# EAGLE design Franzininho (EAGLE 9.0.1)
CNAME: Franzininho; VERSION: V2
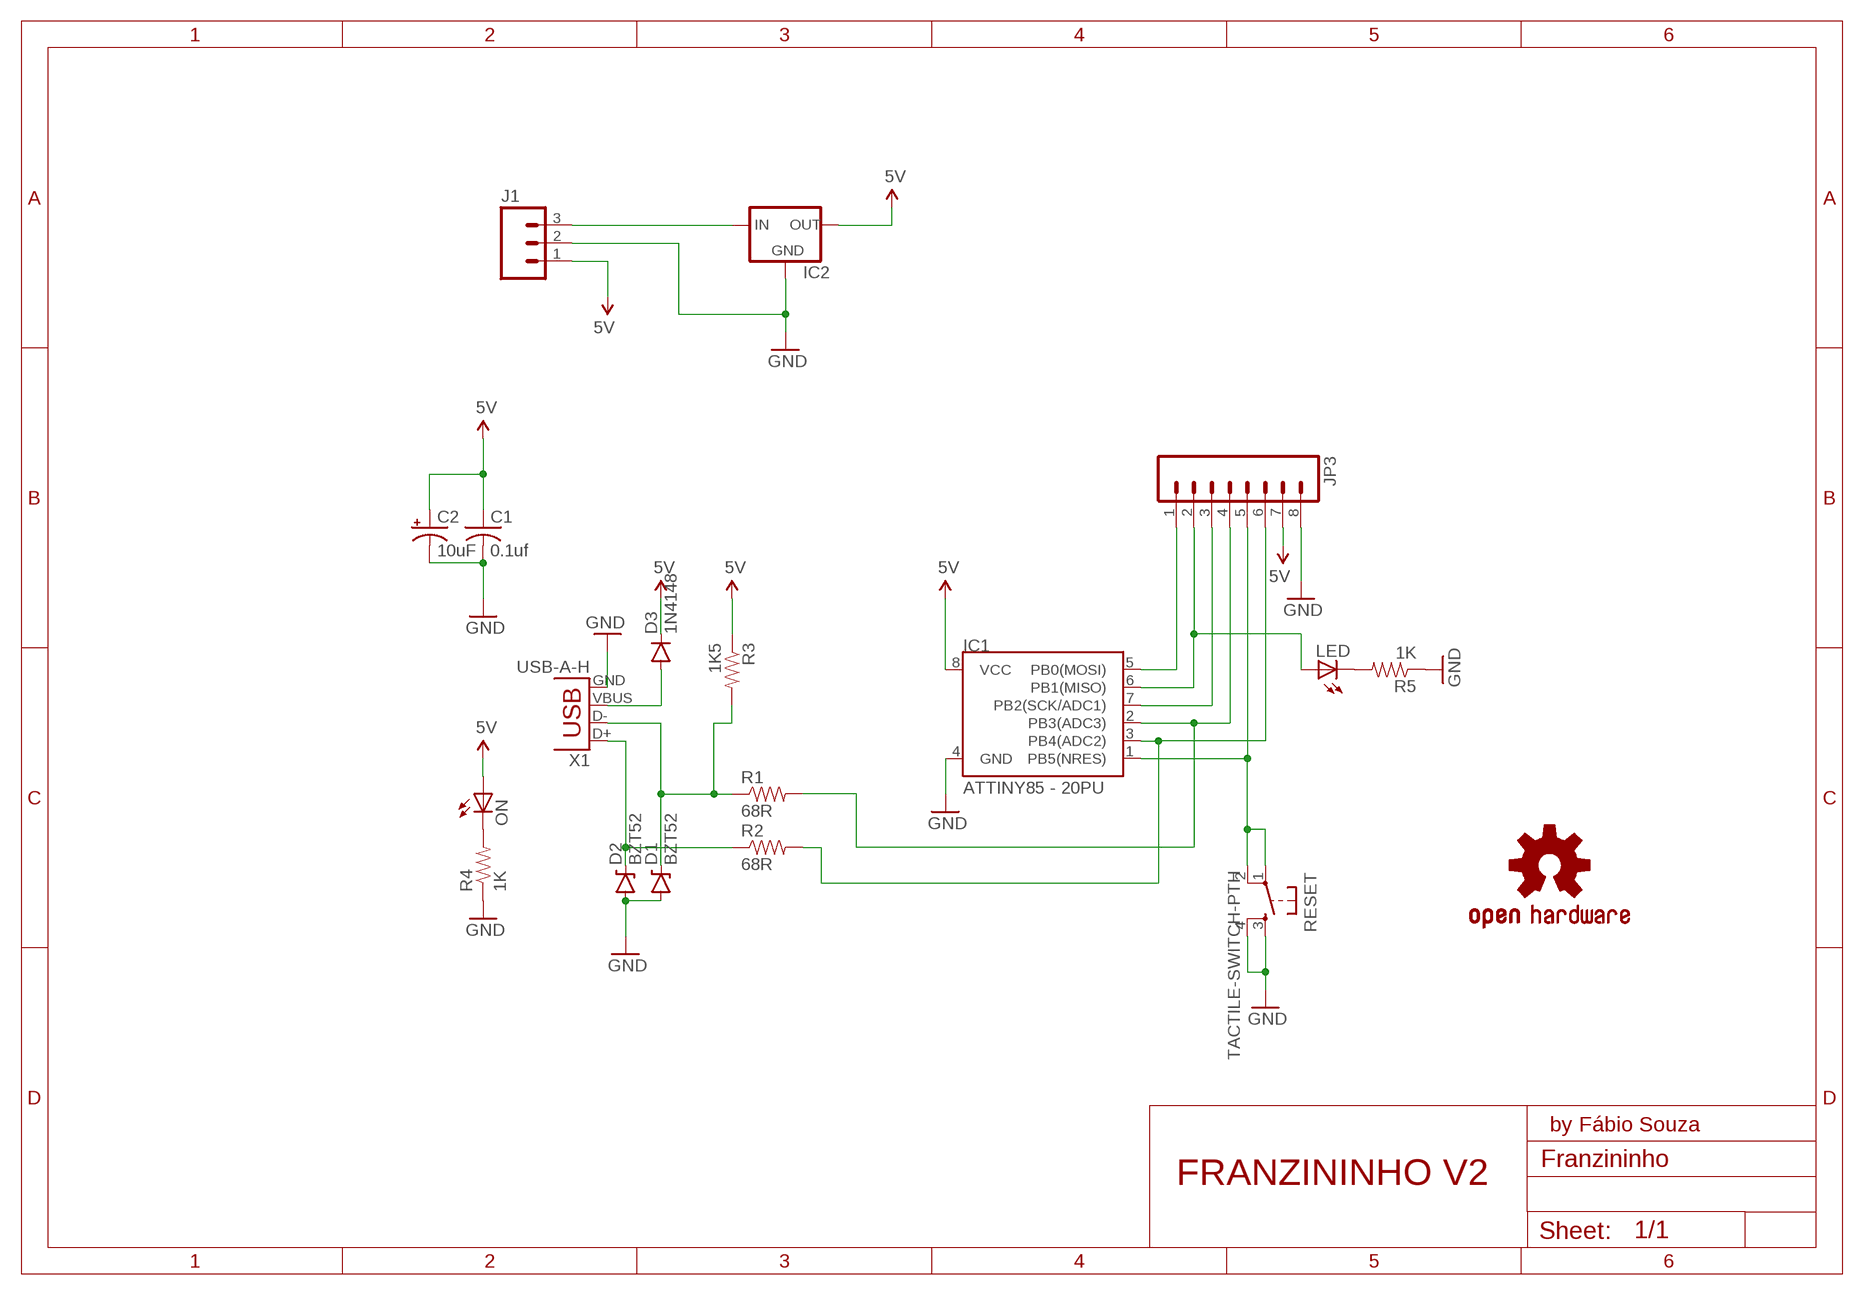
[diagram p0: schematic, sheet 1]

## Parts
C1  0.1uf  C-US025-025X050  [C025-025X050]
C2  10uF  CPOL-USE2,5-6E  [E2,5-6E]
D1  BZT52  DIODE-ZENER  [DIODE-BZT52]
D2  BZT52  DIODE-ZENER  [DIODE-BZT52]
D3  1N4148  DIODE1N4148  [DIODE-1N4148]
IC1  ATTINY85 - 20PU  ATTINY45TINY45-20-DIP  [DIP08]
IC2  78LXX  [78LXX]
J1  M03PTH  [1X03]
JP3  M08  [1X08_ROUND]
LED  LED3MM  [LED3MM]
LOGO1  OSHW-LOGOM  [OSHW-LOGO-M]
ON  LED3MM  [LED3MM]
R1  68R  RESISTORPTH-1/4W  [AXIAL-0.4]
R2  68R  RESISTORPTH-1/4W  [AXIAL-0.4]
R3  1K5  RESISTORPTH-1/4W  [AXIAL-0.4]
R4  1K  RESISTORPTH-1/4W  [AXIAL-0.4]
R5  1K  RESISTORPTH-1/4W  [AXIAL-0.4]
RESET  TACTILE-SWITCH-PTH  [TAC-SWITCH-PTH]
X1  USB-A-H  [USB-A-H]

## Nets
5V: C1.1 C2.+ D3.C IC1.8(VCC) IC2.OUT J1.1 JP3.7 ON.A R3.P$1
GND: C1.2 C2.- D1.A D2.A IC1.4(GND) IC2.GND J1.2 JP3.8 R4.P$1 R5.P$1 RESET.3 RESET.4 X1.GND
N$1: IC1.2(PB3(ADC3)) JP3.4 R1.P$2
N$2: IC1.6(PB1(MISO)) JP3.2 LED.A
N$3: IC1.5(PB0(MOSI)) JP3.1
N$4: D3.A X1.VBUS
N$5: IC1.7(PB2(SCK/ADC1)) JP3.3
N$6: IC1.3(PB4(ADC2)) JP3.6 R2.P$2
N$7: IC2.IN J1.3
N$8: IC1.1(PB5(NRES)) JP3.5 RESET.1 RESET.2
N$10: D1.C R1.P$1 R3.P$2 X1.D-
N$11: D2.C R2.P$1 X1.D+
N$12: LED.K(C) R5.P$2
N$17: ON.K(C) R4.P$2

## Notes on the sheet
- by Fábio Souza
- FRANZININHO V2

## Library data of the parts
C1 = adafruit:C-US: CAPACITOR, American symbol
C2 = adafruit:CPOL-US: POLARIZED CAPACITOR, American symbol
D1 D2 = SparkFun-DiscreteSemi:DIODE-ZENER: Zener Diode Production Part - 8199 3.4V Zener Voltage; PROD-ID: DIO-08199
D3 = SparkFun-DiscreteSemi:DIODE: Diode These are standard reverse protection diodes and small signal diodes. SMA package can handle up to about 1A. SOD-323 can handle about 200mA. What the SOD-323 package when ordering, there are some mfgs out there that are 5-pin packages.; PROD_ID: DIO-08378
IC1 = SparkFun-DigitalIC:ATTINY45: Atmel 8-pin 2/4/8kB flash uC; PROD_ID: IC-09439; VALUE: TINY45-20-DIP
IC2 = v-reg:78LXX: VOLTAGE REGULATOR
J1 = SparkFun-Connectors:M03: Header 3 Standard 3-pin 0.1" header. Use with straight break away headers (SKU : PRT-00116), right angle break away headers (PRT-00553), swiss pins (PRT-00743), machine pins (PRT-00117), and female headers (PRT-00115). Molex polarized connector foot print use with SKU : PRT-08232 with associated crimp pins and housings.
JP3 = SparkFun-Connectors:M08: Header 8 Standard 8-pin 0.1" header. Use with straight break away headers (SKU : PRT-00116), right angle break away headers (PRT-00553), swiss pins (PRT-00743), machine pins (PRT-00117), and female headers (PRT-00115).; PROD_ID: CONN-08437
LED ON = adafruit:LED: LED OSRAM: - CHIPLED LG R971, LG N971, LY N971, LG Q971, LY Q971, LO R971, LY R971 LH N974, LH R974 LS Q976, LO Q976, LY Q976 LO Q996 - Hyper CHIPLED LW Q18S LB Q993, LB Q99A, LB R99A - SideLED LS A670, LO A670, LY A670, LG A670, LP A670 LB A673, LV A673, LT A673, LW A673 LH A674 LY A675 LS A676, LA A676, LO A676, LY A676, LW A676 LS A679, LY A679, LG A679 - Hyper Micro SIDELED® LS Y876, LA Y876, LO Y876, LY Y876 LT Y87S - SmartLED LW L88C, LW L88S LB L89C, LB L89S, LG L890 LS L89K, LO L89K, LY L89K LS L896, LA L896, LO L896, LY L896 - TOPLED LS T670, LO T670, LY T670, LG T670, LP T670 LSG T670, LSP T670, LSY T670, LOP T670, LYG T670 LG T671, LOG T671, LSG T671 LB T673, LV T673, LT T673, LW T673 LH T674 LS T676, LA T676, LO T676, LY T676, LB T676, LH T676, LSB T676, LW T676 LB T67C, LV T67C, LT T67C, LS T67K, LO T67K, LY T67K, LW E67C LS E67B, LA E67B, LO E67B, LY E67B, LB E67C, LV E67C, LT E67C LW T67C LS T679, LY T679, LG T679 LS T770, LO T770, LY T770, LG T770, LP T770 LB T773, LV T773, LT T773, LW T773 LH T774 LS E675, LA E675, LY E675, LS T675 LS T776, LA T776, LO T776, LY T776, LB T776 LHGB T686 LT T68C, LB T68C - Hyper Mini TOPLED® LB M676 - Mini TOPLED Santana® LG M470 LS M47K, LO M47K, LY M47K Source: http://www.osram.convergy.de/
LOGO1 = SparkFun-Aesthetics:OSHW-LOGO: Open Source Hardware Logo This logo indicates the piece of hardware it is found on incorporates a OSHW license and/or adheres to the definition of open source hardware found here: http://freedomdefined.org/OSHW
R1-R5 = SparkFun-Passives:RESISTOR: Resistor Basic schematic elements and footprints for 0603, 1206, and PTH resistors.
RESET = GeekAmmo:TACTILE-SWITCH: Tactile Switch 4 Pins, SPST NO
X1 = SparkFun-Connectors:USB: USB Connectors USB-B-PTH is fully proven SKU : PRT-00139/CONN-08278 USB-miniB is fully proven SKU : PRT-00587 USB-A-PCB is untested. USB-A-H is throughly reviewed, but untested. Spark Fun Electronics SKU : PRT-00437 USB-B-SMT is throughly reviewed, but untested. Needs silkscreen touching up. USB-A-S has not been used/tested USB-MB-H has not been used/tested USB-MICROB has been used. CONN-09505; PROD_ID: CONN-08367

## Board
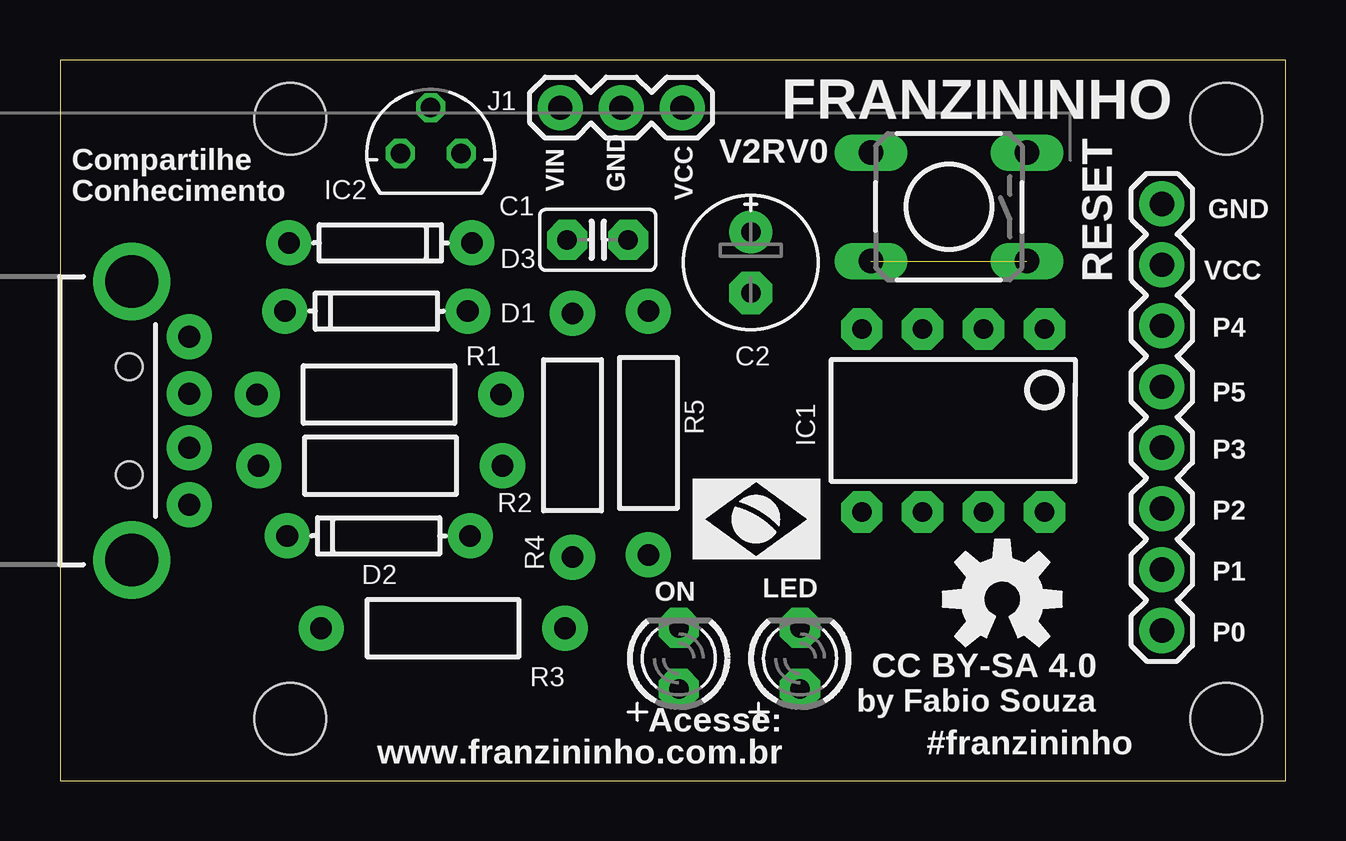
[diagram p1: board, top side]
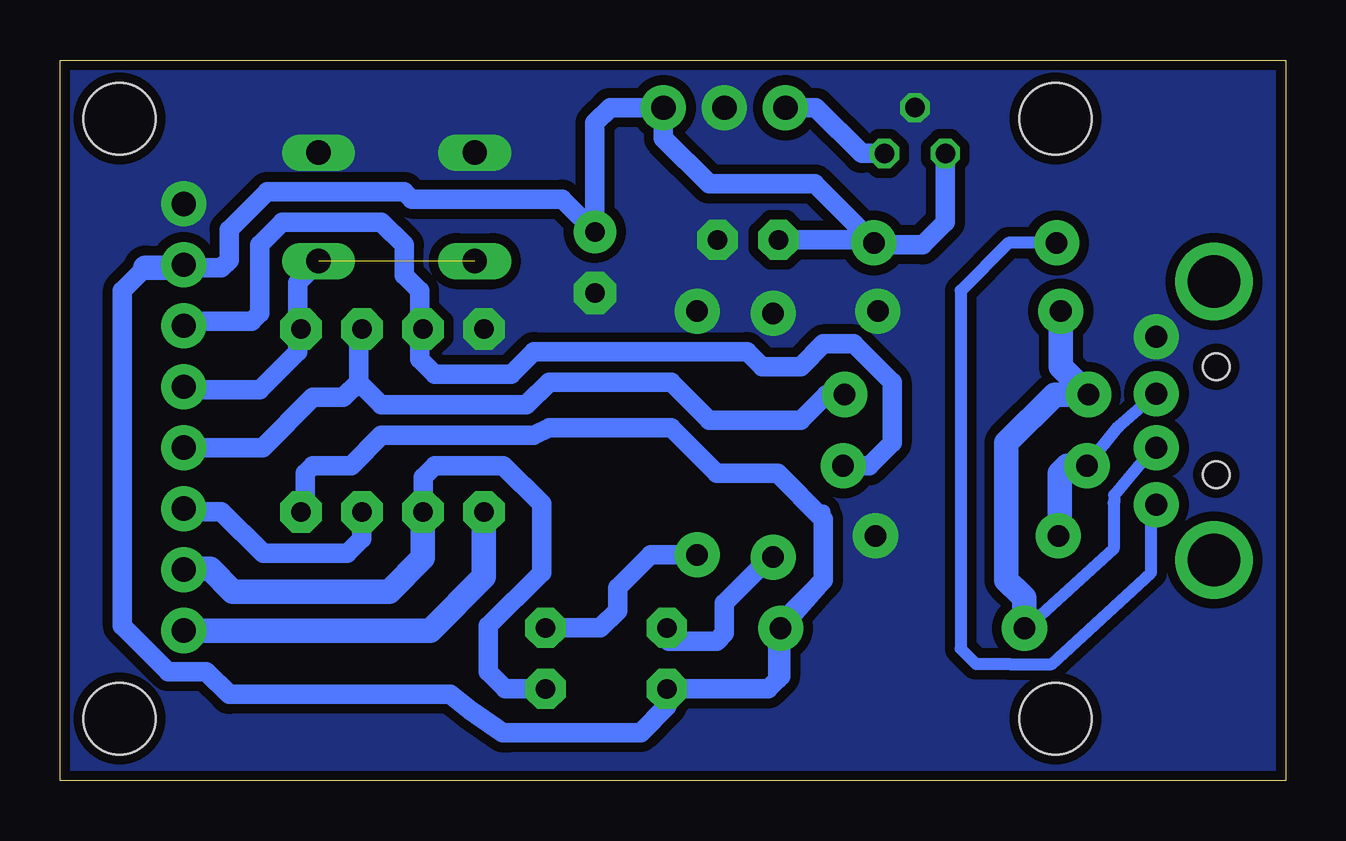
[diagram p2: board, bottom side, seen from below]

Size 51.07 x 30.03 mm. Coordinates in mm from the lower left corner, seen from the top.
Outline: 0,0 51.07,0 51.07,30.03 0,30.03 0,0
Copper layers (1*16): Top 0.0356mm / dielectric 1.5011mm / Bottom 0.0356mm
Design rules "default *": minimum track width 8mil, minimum drill 13mil, track to track 12mil, track to pad 12mil, pad to pad 12mil, via to via 12mil, smd to smd 8mil, copper to edge 15mil, drill to drill 15mil, minimum pad ring 7mil, minimum via ring 7mil, stop-mask expansion 4mil, vias tented up to drill 25mil, thermal gap 10mil
Holes 3 mm at 9.6,27.58 48.59,27.58 48.59,2.58 9.6,2.58

### Footprints (pad centres in the part's own frame; a part is rotated, then mirrored left to right if it is on the bottom)
C025-025X050 = drill 0.813 pad 1.676 octagon: 1 -1.27,0; 2 1.27,0
E2,5-6E = drill 0.813 pad 1.778: + -1.27,0 | drill 0.813 pad 1.778 octagon: - 1.27,0
DIODE-BZT52 = drill 0.9 pad 1.88: A -3.81,0; C 3.81,0
DIODE-1N4148 = drill 0.9 pad 1.88: A -3.81,0; C 3.81,0
DIP08 = drill 0.813 pad 1.727 octagon: 1 -3.81,-3.81; 2 -1.27,-3.81; 3 1.27,-3.81; 4 3.81,-3.81; 5 3.81,3.81; 6 1.27,3.81; 7 -1.27,3.81; 8 -3.81,3.81
78LXX = drill 0.813 octagon: GND 0,1.905; IN 1.27,0; OUT -1.27,0
1X03 = drill 1.016 pad 1.88: 1 0,0; 2 2.54,0; 3 5.08,0
1X08_ROUND = drill 1.016 pad 1.88: 1 0,0; 2 2.54,0; 3 5.08,0; 4 7.62,0; 5 10.16,0; 6 12.7,0; 7 15.24,0; 8 17.78,0
LED3MM = drill 0.813 pad 1.676 octagon: A -1.27,0; K 1.27,0
AXIAL-0.4 = drill 0.9 pad 1.88: P$1 -5.08,0; P$2 5.08,0
TAC-SWITCH-PTH = drill 1.016 pad 1.524 long: 1 -3.251,2.261; 2 3.251,2.261; 3 -3.251,-2.261; 4 3.251,-2.261
USB-A-H = drill 0.914 pad 1.88: D+ 2.4,1.127; D- 2.4,-1.127; GND 2.4,3.5; VBUS 2.4,-3.5 | drill 2.2: GND2 0,-5.8; GND3 0,5.8 | hole 1.1: -0.1,2.25; -0.1,-2.25

### Placement (x,y rotation side)
C1  22.4,22.54 0 top
C2  28.78,21.6 270 top
D1  13.18,19.57 180 top
D2  13.28,10.2 180 top
D3  13.35,22.41 0 top
IC1  37.22,15 180 top
IC2  15.45,26.14 0 top
J1  25.92,28.04 180 top
JP3  45.91,6.26 90 top
LED  30.84,5.1 90 top
LOGO1  39.26,7.56 0 top
ON  25.78,5.1 90 top
R1  13.29,16.09 0 top
R2  13.36,13.13 0 top
R3  15.96,6.36 180 top
R4  21.35,14.4 270 top
R5  24.52,14.49 270 top
RESET  37.04,23.91 180 top
X1  2.99,15 0 top

### Tracks (layer width: path | path; a pad name or v marks a point on that pad's centre or on a via)
5V
  Bottom 0.406: D3.C 17.12,22.41 17.04,22.33 | 46.27,21.38 JP3.7
  Bottom 0.61: 19.26,11.22 19.26,10.9
  Bottom 0.813: 19.26,8.38 19.26,10.9 21.16,12.8 23.7,12.8 25.61,14.71 30.69,14.71 31.32,14.39 37.67,14.39 38.94,13.12 40.53,13.12 40.85,12.8 40.85,11.37 IC1.8 | 19.26,8.38 R3.P$1 21.04,4.35 21.16,4.23 | 47.52,21.38 48.47,20.42 48.47,6.45 46.56,4.55 44.98,4.55 44.02,3.6 34.81,3.6 33.96,2.94 32.61,1.99 32.27,2.01 26.88,2.01 25.78,3.1 ON.A 21.56,3.83 21.16,4.23 | JP3.7 45.79,21.38 44.34,21.38 44.02,21.69 44.02,22.96 42.44,24.55 36.72,24.55 36.4,24.23 30.15,24.23 C2.+ 28.78,27.41 28.15,28.04 J1.1 25.92,26.77 24.02,24.87 19.62,24.87 D3.C | 19.26,8.38 19.26,8.36 21.16,6.45 21.16,4.23 | C1.1 17.29,22.54 D3.C | IC2.OUT 14.18,23.28 15.13,22.33 17.08,22.33 D3.C
  Bottom 1.016: 47.52,21.38 46.03,21.38 JP3.7
GND
  pour Bottom (isolate 0.406, no thermals): 0,29.88 51.03,29.88 51.1,0.01 0,-0.08
N$1
  Bottom 0.813: 38.62,16.61 37.67,15.66 31.64,15.66 30.69,16.61 25.61,16.61 24.02,15.02 20.21,15.02 19.14,16.09 R1.P$2 | 38.62,16.61 38.62,18.68 IC1.2 | JP3.4 42.63,13.88 40.53,15.98 39.26,15.98 38.62,16.61
N$2
  Bottom 0.406: 35.93,11.21 IC1.6
  Bottom 0.813: 35.93,11.21 35.93,12.64 35.45,13.12 32.59,13.12 31,11.53 31,8.67 33.23,6.45 33.23,4.55 32.51,3.83 LED.A
  Bottom 1.016: IC1.6 35.95,9.29 37.35,7.88 43.86,7.88 44.82,8.83 45.88,8.83 JP3.2
N$3
  Bottom 1.016: IC1.5 33.41,8.5 35.64,6.26 JP3.1
N$4
  Bottom 0.508: D3.A 11.56,22.41 13.54,20.42 13.54,5.5 12.91,4.86 11.51,4.86 11.5,4.86 9.74,4.86 5.61,8.67 5.61,11.28 X1.VBUS
N$5
  Bottom 0.813: IC1.7 38.49,10.08 39.1,9.47 42.59,9.47 44.34,11.22 45.79,11.22 JP3.3
N$6
  Bottom 0.406: 36.09,18.68 IC1.3
  Bottom 0.61: R2.P$2
  Bottom 0.813: R2.P$2 17.35,13.12 16.4,14.07 16.4,16.61 17.99,18.2 19.26,18.2 20.21,17.25 21.8,17.25 22.43,17.88 31.32,17.88 32.27,16.93 35.45,16.93 36.09,17.57 36.09,18.68 36.09,20.42 36.72,21.06 36.72,22.33 37.67,23.28 41.8,23.28 42.75,22.33 42.75,19.47 43.07,19.15 45.72,19.15 JP3.6 45.79,18.84
N$7
  Bottom 0.813: IC2.IN 17.67,26.14 19.58,28.04 J1.3
N$8  (1 unrouted)
  Bottom 0.61: 45.79,16.29 JP3.5 | IC1.1 41.16,18.68
  Bottom 0.813: 41.16,18.68 41.16,17.88 42.75,16.29 45.79,16.29 | RESET.1 40.29,21.62 41.16,20.74 41.16,18.95 IC1.1
N$10
  Bottom 0.406: 11,7.72 10.98,7.72 10.88,7.63 | X1.D- 5.49,13.87 | 7.15,11.58 7.16,11.56
  Bottom 0.508: 5.49,13.87 7.15,11.9 7.15,11.58 | 7.16,11.56 7.16,9.66 10.69,6.45 10.66,6.14 R3.P$2
  Bottom 1.016: D1.C 9.37,17.25 R1.P$1 9.62,16.09 11.64,14.07 11.64,8.36 11,7.72 | R3.P$2 10.88,7.63
N$11
  Bottom 0.508: X1.D+ 6.97,14.75 R2.P$1
  Bottom 0.61: R2.P$1 8.28,12.99 | 9.42,10.26 D2.C
  Bottom 1.016: 9.42,10.26 9.42,12.8 9.1,13.12 R2.P$1
N$12
  Bottom 0.813: R5.P$2 26.46,9.41 27.83,8.04 27.83,7.09 28.55,6.37 LED.K
N$17
  Bottom 0.813: R4.P$2 21.48,9.32 23.38,7.4 23.38,6.14 23.7,5.82 25.7,5.82 ON.K

### Text on the board
tNames: FRANZININHO | VCC | V2RV0 | VIN | GND | GND | Compartilhe / Conhecimento | VCC | P4 | P5 | P3 | P2 | P1 | P0 | CC BY-SA 4.0 | Acesse: / www.franzininho.com.br | by Fabio Souza | #franzininho